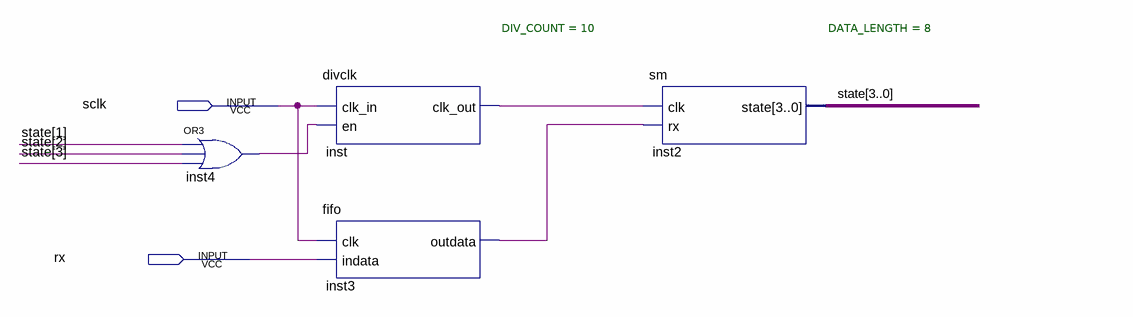
[diagram p0: schematic sheet]
// Quartus schematic uart.bdf as structural Verilog: 4 symbols, 2 pins
module uart (
  input  sclk,
  input  rx
);

  wire inst3_outdata, inst4_out, inst_clk_out;
  wire [3:0] state;

  or inst4 (inst4_out, state[1], state[2], state[3]);
  divclk #(.DIV_COUNT(10)) inst (.clk_in(sclk), .en(inst4_out), .clk_out(inst_clk_out));
  fifo inst3 (.clk(sclk), .indata(rx), .outdata(inst3_outdata));
  sm #(.DATA_LENGTH(8)) inst2 (.clk(inst_clk_out), .rx(inst3_outdata), .state(state));
endmodule
